# EAGLE design DisplayModuleV1 (EAGLE 9.5.2)
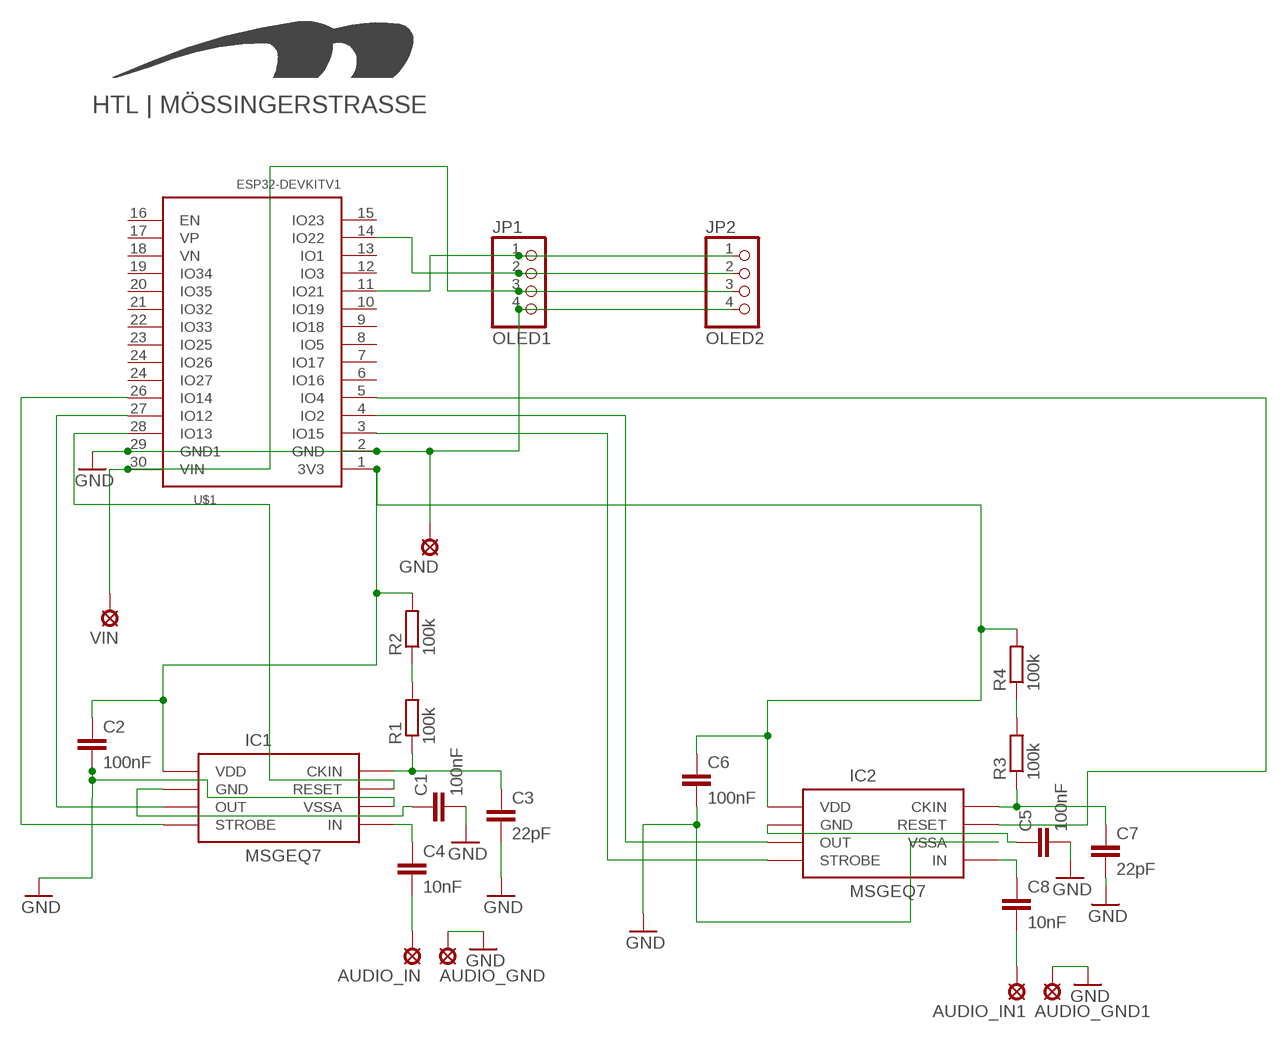
[diagram p0: schematic, sheet 1]

## Parts
AUDIO_GND  LSP10  [LSP10]
AUDIO_GND1  LSP10  [LSP10]
AUDIO_IN  LSP10  [LSP10]
AUDIO_IN1  LSP10  [LSP10]
C1  100nF  C-EU050-030X075  [C050-030X075]
C2  100nF  C-EU050-030X075  [C050-030X075]
C3  22pF  C-EU050-030X075  [C050-030X075]
C4  10nF  C-EU050-030X075  [C050-030X075]
C5  100nF  C-EU050-030X075  [C050-030X075]
C6  100nF  C-EU050-030X075  [C050-030X075]
C7  22pF  C-EU050-030X075  [C050-030X075]
C8  10nF  C-EU050-030X075  [C050-030X075]
GND  LSP10  [LSP10]
IC1  MSGEQ7DIP  [DIL08]
IC2  MSGEQ7DIP  [DIL08]
JP1  OLED1  PINHD-1X4  [1X04]
JP2  OLED2  PINHD-1X4  [1X04]
R1  100k  R-EU_0204/7  [0204/7]
R2  100k  R-EU_0204/7  [0204/7]
R3  100k  R-EU_0204/7  [0204/7]
R4  100k  R-EU_0204/7  [0204/7]
U$1  ESP32DEVKITV1  [ESP32-DEVKITV1]
U$2  HTL_LOGOBOTTOP_15MM  [LOGO_15]
VIN  LSP10  [LSP10]

## Nets
GND: AUDIO_GND1.MP AUDIO_GND.MP C1.2 C2.2 C3.2 C5.2 C6.2 C7.2 GND.MP IC1.2(VSSA) IC2.2(VSSA) JP1.4 JP2.4 U$1.2(GND) U$1.29(GND1)
N$1: C2.1 C6.1 IC1.1(VDD) IC2.1(VDD) R2.2 R4.2 U$1.1(3V3)
N$2: R1.2 R2.1
N$3: C3.1 IC1.8(CKIN) R1.1
N$4: IC1.7(RESET) U$1.28(IO13)
N$5: IC1.3(OUT) U$1.27(IO12)
N$6: IC1.4(STROBE) U$1.26(IO14)
N$7: C1.1 IC1.6(GND)
N$8: C4.1 IC1.5(IN)
N$9: AUDIO_IN.MP C4.2
N$10: IC2.7(RESET) U$1.5(IO4)
N$11: R3.2 R4.1
N$12: C7.1 IC2.8(CKIN) R3.1
N$14: IC2.3(OUT) U$1.4(IO2)
N$15: IC2.4(STROBE) U$1.3(IO15)
N$16: C5.1 IC2.6(GND)
N$17: C8.1 IC2.5(IN)
N$18: AUDIO_IN1.MP C8.2
N$20: JP1.1 JP2.1 U$1.11(IO21)
N$21: JP1.2 JP2.2 U$1.14(IO22)
N$22: JP1.3 JP2.3 U$1.30(VIN) VIN.MP
Unconnected: U$1.6(IO16) U$1.7(IO17) U$1.8(IO5) U$1.9(IO18) U$1.10(IO19) U$1.12(IO3) U$1.13(IO1) U$1.15(IO23) U$1.16(EN) U$1.17(VP) U$1.18(VN) U$1.19(IO34) U$1.20(IO35) U$1.21(IO32) U$1.22(IO33) U$1.23(IO25) U$1.24(IO26) U$1.24(IO27)

## Library data of the parts
AUDIO_GND AUDIO_GND1 AUDIO_IN AUDIO_IN1 GND VIN = solpad:LSP10: SOLDER PAD drill 1.0 mm, distributor Buerklin, 12H555
C1-C8 = rcl:C-EU: CAPACITOR, European symbol; SPICEPREFIX: C
IC1 IC2 = msgeq7:MSGEQ7: 7-band graphic equalizer
JP1 JP2 = pinhead:PINHD-1X4: PIN HEADER
R1-R4 = rcl:R-EU_: RESISTOR, European symbol; SPICEPREFIX: R
U$1 = ESP32-DEVKITV1:ESP32DEVKITV1
U$2 = HTL-Logo:HTL_LOGO

## Board
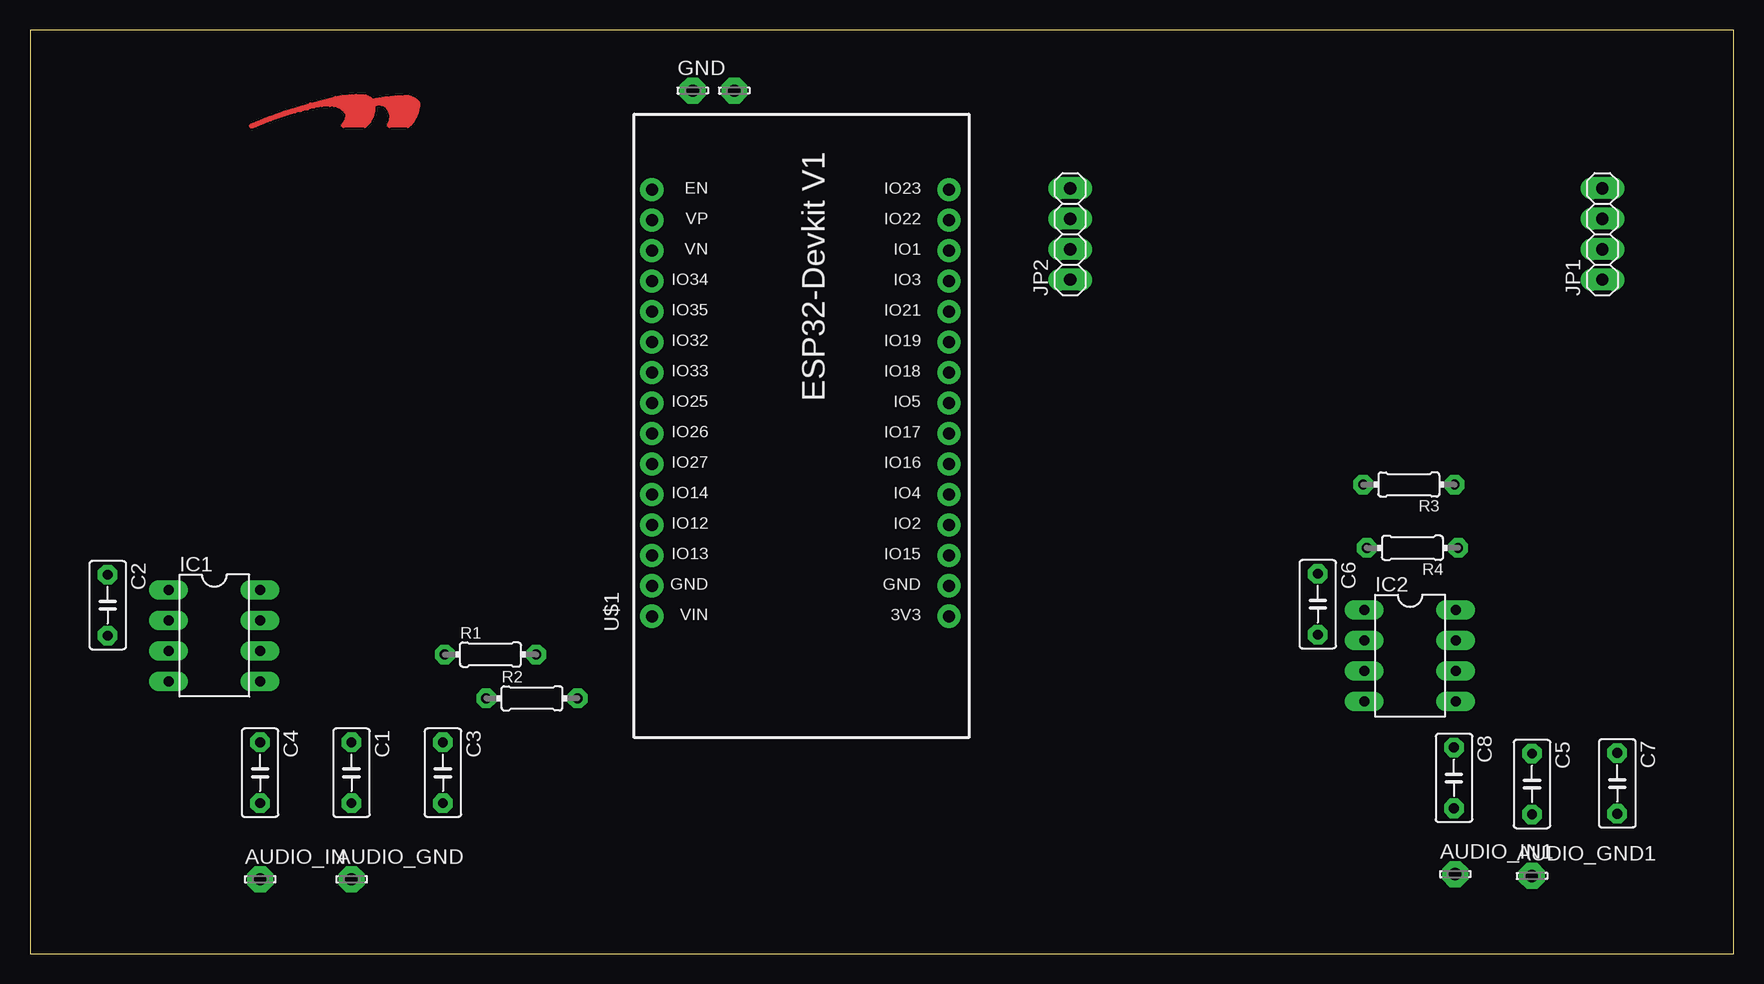
[diagram p1: board, top side]
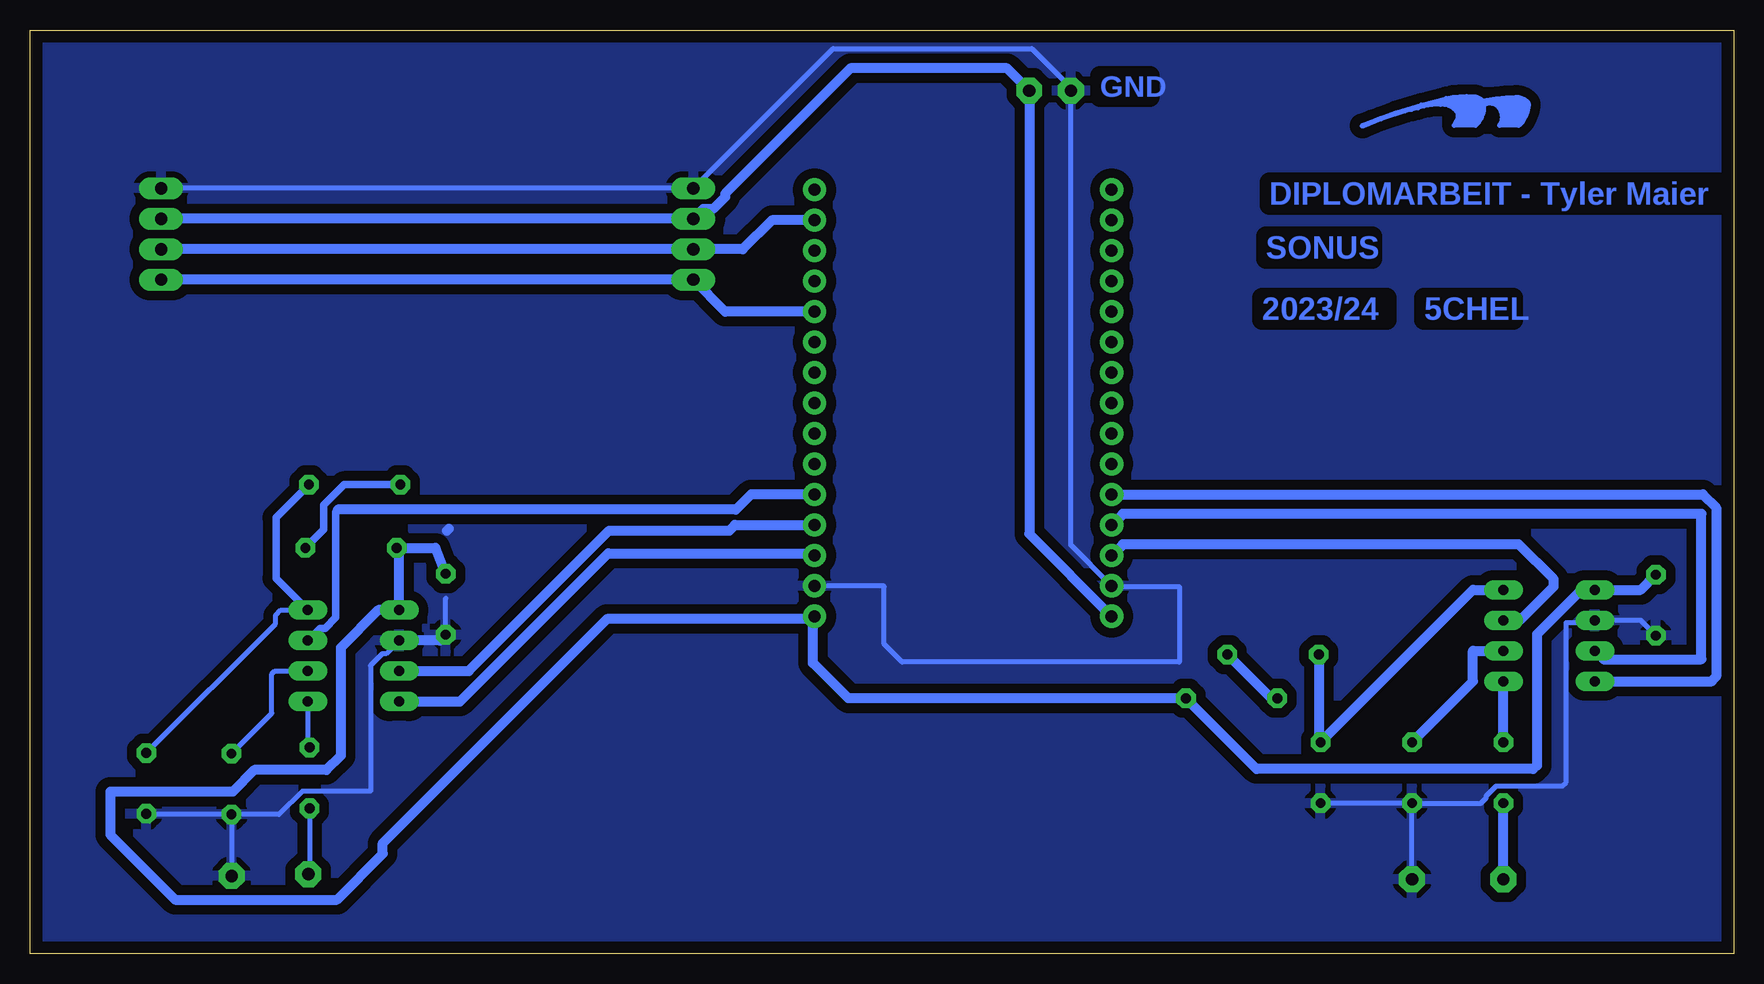
[diagram p2: board, bottom side, seen from below]

Size 142 x 77 mm. Coordinates in mm from the lower left corner, seen from the top.
Outline: 0,0 142,0 142,77 0,77 0,0
Copper layers (1*16): Top 0.035mm / dielectric 1.5mm / Bottom 0.035mm
Design rules "htl-klu": minimum track width 16mil, minimum drill 0.35mm, track to track 16mil, track to pad 16mil, pad to pad 16mil, via to via 16mil, smd to smd 6mil, copper to edge 40mil, drill to drill 6mil, minimum pad ring 16mil, minimum via ring 8mil, stop-mask expansion 4mil, vias tented up to drill 0mil, thermal gap 20mil

### Footprints (pad centres in the part's own frame; a part is rotated, then mirrored left to right if it is on the bottom)
LSP10 = drill 1.016 pad 2.159 octagon: MP 0,0
C050-030X075 = drill 0.813 octagon: 1 -2.54,0; 2 2.54,0
DIL08 = drill 0.813 long: 1 -3.81,-3.81; 2 -1.27,-3.81; 3 1.27,-3.81; 4 3.81,-3.81; 5 3.81,3.81; 6 1.27,3.81; 7 -1.27,3.81; 8 -3.81,3.81
1X04 = drill 1.016 long: 1 -3.81,0; 2 -1.27,0; 3 1.27,0; 4 3.81,0
0204/7 = drill 0.813 octagon: 1 -3.81,0; 2 3.81,0
ESP32-DEVKITV1 = drill 1 pad 1.93: 1 -22.87,-13.54; 2 -20.33,-13.54; 3 -17.79,-13.54; 4 -15.25,-13.54; 5 -12.71,-13.54; 6 -10.17,-13.54; 7 -7.63,-13.54; 8 -5.09,-13.54; 9 -2.55,-13.54; 10 -0.01,-13.54; 11 2.53,-13.54; 12 5.07,-13.54; 13 7.61,-13.54; 14 10.15,-13.54; 15 12.69,-13.54; 16 12.69,11.23; 17 10.15,11.23; 18 7.61,11.23; 19 5.07,11.23; 20 2.53,11.23; 21 -0.01,11.23; 22 -2.55,11.23; 23 -5.09,11.23; 24 -7.63,11.23; 25 -10.17,11.23; 26 -12.71,11.23; 27 -15.25,11.23; 28 -17.79,11.23; 29 -20.33,11.23; 30 -22.87,11.23

### Placement (x,y rotation side)
AUDIO_GND  26.8,6.18 0 top
AUDIO_GND1  125.2,6.47 0 top
AUDIO_IN  19.18,6.18 0 top
AUDIO_IN1  118.8,6.62 0 top
C1  26.8,15.07 270 top
C2  6.48,29.04 270 top
C3  34.42,15.07 270 top
C4  19.18,15.07 270 top
C5  125.2,14.14 270 top
C6  107.35,29.12 270 top
C7  132.31,14.19 270 top
C8  118.7,14.64 270 top
GND  55.24,71.95 0 top
IC1  15.37,26.5 270 top
IC2  115.04,24.83 270 top
JP1  131.07,59.99 90 top
JP2  86.7,59.99 90 top
R1  38.38,24.93 0 top
R2  41.84,21.27 0 top
R3  114.94,39.1 180 top
R4  115.24,33.82 180 top
U$1  63.07,50.99 90 top
U$2  24.71,69.04 0 top
VIN  58.71,71.95 0 top

### Tracks (layer width: path | path; a pad name or v marks a point on that pad's centre or on a via)
GND
  Bottom 0.406: 55.24,34.06 U$1.29 51.78,30.6 46.2,30.6 46.2,24.3 69.3,24.3 70.8,25.8 70.8,30.6 70.86,30.66 U$1.2
  Bottom 0.432: AUDIO_GND.MP C1.2 | C1.2 C3.2 | C2.2 7.75,27.77 IC1.2 11.73,27.6 13.95,27.6 13.95,14.29 14.26,13.97 19.77,13.97 20.61,13.13 20.61,12.98 21.06,12.53 C1.2 | C5.2 AUDIO_GND1.MP | C5.2 132.26,11.6 C7.2 | IC2.2 112.33,24.99 112.64,24.99 113.62,24.01 113.62,13.54 119.29,13.54 121.23,11.6 C5.2 | 107.83,26.1 C6.2 107.34,29.63 | U$1.29 51.84,30.36 | JP1.4 JP2.4 75.05,75.45 58.5,75.45 55.24,72.19 GND.MP 55.24,34.06
  Bottom 0.813: 107.83,26.1 IC2.2 | 107.1,35.4 107.25,35.26
  pour Bottom (isolate 0.813): 0,77.1 141.9,77.1 141.9,0 0,0
  pour Bottom (isolate 0.813): 0,77.1 0,0 141.9,0 141.9,76.8 0.3,76.8
N$1
  Bottom 0.432: 16.39,15.68 16.69,15.38 | 76.73,27.88 76.73,28 U$1.1 | 111.23,33.62 R4.2
  Bottom 0.813: C2.1 7.75,30.31 IC1.1 12.69,30.31 16.39,26.62 16.39,15.68 | 16.69,15.38 39.75,15.38 R2.2 73.79,21.27 76.73,24.22 76.73,27.88 93.9,27.88 112.59,9.19 112.59,8.31 116.4,4.5 129.9,4.5 135.3,9.9 135.3,13.5 125.1,13.5 123.3,15.3 117.3,15.3 116.1,16.5 116.1,25.5 112.96,28.64 IC2.1 111.23,33.62 | R4.2 108.2,33.82 C6.1
N$2
  Bottom 0.432: 38.53,21.27 R2.1
  Bottom 0.813: R1.2 38.53,21.27
N$3
  Bottom 0.432: 34.57,17.77 C3.1
  Bottom 0.813: R1.1 34.57,17.77 | C3.1 21.72,30.31 IC1.8
N$4
  Bottom 0.813: U$1.28 50.92,34.12 17.91,34.12 15,31.22 15,30.6 17.83,27.77 IC1.7
N$5
  Bottom 0.432: IC1.3 10.85,24.52
  Bottom 0.813: U$1.27 50.92,36.66 2.67,36.66 2.67,24.52 10.85,24.52
N$6
  Bottom 0.813: IC1.4 1.8,22.69 1.8,22.74 1.45,23.09 1.45,37.17 2.56,38.28 U$1.26
N$7
  Bottom 0.813: C1.1 21.72,22.69 21.72,25.23 IC1.6
N$8
  Bottom 0.813: C4.1 IC1.5
N$9
  Bottom 0.813: AUDIO_IN.MP C4.2
N$10
  Bottom 0.61: IC2.7 117.83,27.11 117.4,27.11 116.51,28.01 116.51,36.83 116.33,37.01
  Bottom 0.813: 116.33,37.01 83.15,37.01 81.88,38.28 U$1.5
N$11
  Bottom 0.61: R4.1 117.53,35.34 117.53,37.39 115.82,39.1 R3.2
N$12
  Bottom 0.432: C7.1 121.54,27.5 121.54,28.18 121.08,28.64 IC2.8
  Bottom 0.61: R3.1 121.5,36.35 121.5,31.29 IC2.8
N$14
  Bottom 0.813: IC2.3 105.44,23.56 93.73,35.27 83.7,35.27 83.23,35.74 U$1.4
N$15
  Bottom 0.432: 76.77,33.36 U$1.3
  Bottom 0.813: IC2.4 106.15,21.02 93.8,33.36 76.77,33.36
N$16
  Bottom 0.432: C5.1 121.85,20.03 121.85,23.3 121.59,23.56 IC2.6
N$17
  Bottom 0.432: IC2.5 118.85,17.34 C8.1
N$18
  Bottom 0.432: C8.2 118.7,6.72 AUDIO_IN1.MP
N$20
  Bottom 0.813: U$1.11 84.05,53.52 JP2.1 JP1.1
N$21
  Bottom 0.813: U$1.14 80.16,61.14 82.58,58.72 JP2.2 JP1.2
N$22
  Bottom 0.813: U$1.30 58.71,34.99 VIN.MP 60.56,73.8 73.61,73.8 84.06,63.35 84.06,63.08 85.07,62.07 85.89,62.07 JP2.3 JP1.3

### Text on the board
Bottom: GND | DIPLOMARBEIT - Tyler Maier | SONUS | 5CHEL | 2023/24